# Altium project czad.PrjPcb
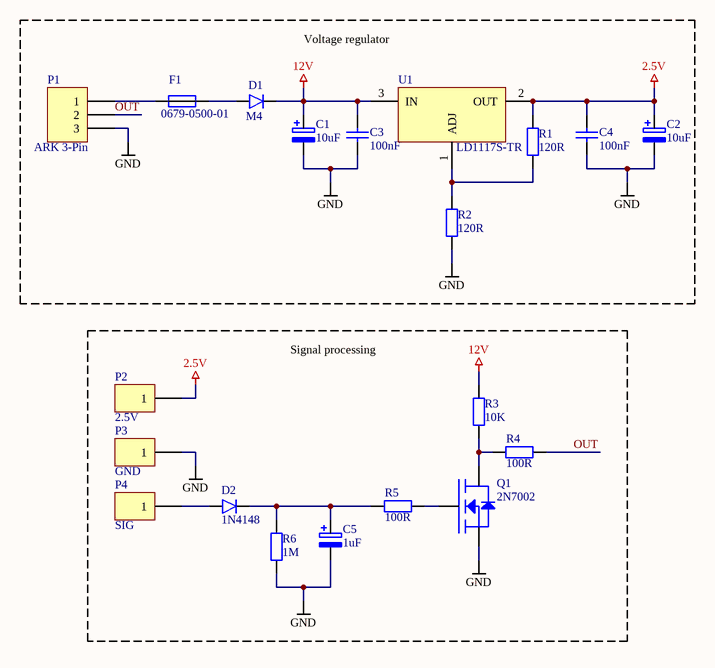
[diagram p0: czad.SchDoc]
1 sheet, 20 parts. Net scope: global (net labels, ports and power ports of the same name join across sheets).
Board file: czad.PcbDoc

## Sheet czad.SchDoc
size A4

### Parts
C1  10uF  [TANC_B]
C2  10uF  [TANC_B]
C3  100nF  [C0805]
C4  100nF  [C0805]
C5  1uF  [TANC_A]
D1  M4  [SMA]
D2  1N4148  [DO-213A]
F1  0679-0500-01  [0679-0500-01]
P1  ARK 3-Pin  [ARK-3.5mm-3pin]
P2  2.5V  [PAD]
P3  GND  [PAD]
P4  SIG  [PAD]
Q1  2N7002  [SOT23]
R1  120R  [R0805]
R2  120R  [R0805]
R3  10K  [R0805]
R4  100R  [R0805]
R5  100R  [R0805]
R6  1M  [R0805]
U1  LD1117S-TR  [SOT-223]

### Blocks framed on the sheet
Voltage regulator: C1-C4 D1 F1 P1 R1 R2 U1
Signal processing: C5 D2 P2-P4 Q1 R3-R6

### Nets
2.5V: C2.1 C4.1 P2.1 R1.1 U1.2(OUT)
12V: C1.1 C3.1 D1.1 R3.1 U1.3(IN)
GND: C1.2 C2.2 C3.2 C4.2 C5.2 P1.3 P3.1 Q1.2(S) R2.2 R6.1
OUT: P1.2 R4.1
NetC5_1: C5.1 D2.1 R5.2 R6.2
NetD1_2: D1.2 F1.2
NetD2_2: D2.2 P4.1
NetF1_1: F1.1 P1.1
NetQ1_1: Q1.1(G) R5.1
NetQ1_3: Q1.3(D) R3.2 R4.2
NetR1_2: R1.2 R2.1 U1.1(ADJ)

### Library data of the parts
C1 C2 C5 = Cap_Pol: Capacitor Polarized
C3 C4 = Cap: Capacitor
D1 D2 = Diode
F1 = 0679-0500-01: Bezpiecznik: topikowy; szybki; ceramiczny; 500mA; 125VAC; 125VDC
P2-P4 = PAD
Q1 = 2N7002(GSD): N-MOSFET
R1-R6 = Res: Resistor
U1 = LD1117S-TR: Stabilizator napiêcia; LDO, liniowy, regulowany; 1,25÷15V; 0,95A